# Altium schematic sheet unodongdiendienap.SchDoc
size A
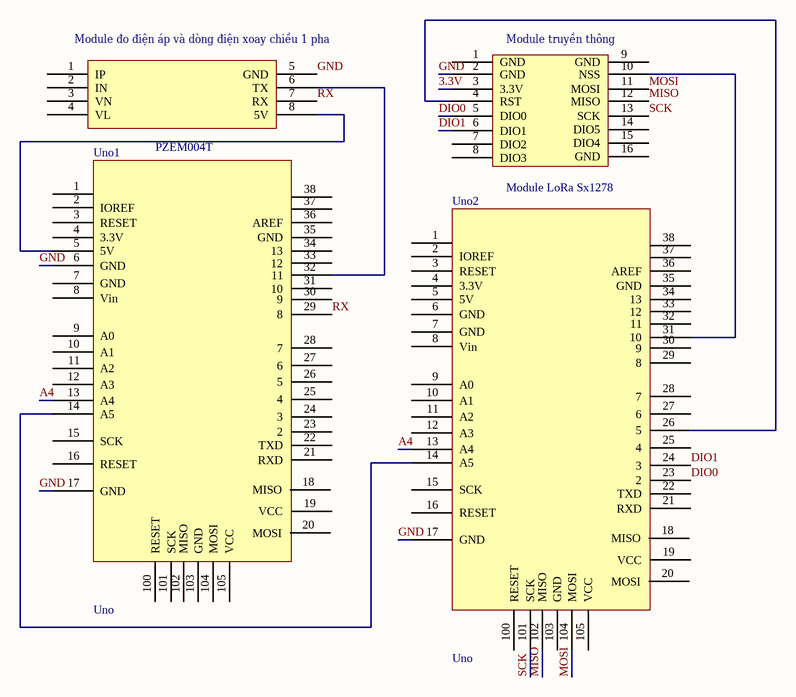
[diagram p0: unodongdiendienap.SchDoc]

## Parts
Module_truyền_thông  Module LoRa Sx1278  [PCBLoRa]
Module_đo_điện_áp_và_dòng_điện_xoay_chiều_1_pha  PZEM004T
Uno1  Uno  [PCBComponent_1]
Uno2  Uno  [PCBComponent_1]

## Nets
3.3V: Module_truyền_thông.3(3.3V)
A4: Uno1.13(A4) Uno2.13(A4)
DIO0: Module_truyền_thông.5(DIO0) Uno2.23(2)
DIO1: Module_truyền_thông.6(DIO1) Uno2.24(3)
GND: Module_truyền_thông.2(GND) Module_đo_điện_áp_và_dòng_điện_xoay_chiều_1_pha.5(GND) Uno1.6(GND) Uno1.17(GND) Uno2.17(GND)
MISO: Module_truyền_thông.12(MISO) Uno2.102(MISO)
MOSI: Module_truyền_thông.11(MOSI) Uno2.104(MOSI)
RX: Module_đo_điện_áp_và_dòng_điện_xoay_chiều_1_pha.7(RX) Uno1.29(8)
SCK: Module_truyền_thông.13(SCK) Uno2.101(SCK)
NetModule_truyền_thông_4: Module_truyền_thông.4(RST) Uno2.26(5)
NetModule_truyền_thông_10: Module_truyền_thông.10(NSS) Uno2.31(10)
NetModule_đo_điện_áp_và_dòng_điện_xoay_chiều_1_pha_6: Module_đo_điện_áp_và_dòng_điện_xoay_chiều_1_pha.6(TX) Uno1.32(11)
NetModule_đo_điện_áp_và_dòng_điện_xoay_chiều_1_pha_8: Module_đo_điện_áp_và_dòng_điện_xoay_chiều_1_pha.8(5V) Uno1.5(5V)
NetUno1_14: Uno1.14(A5) Uno2.14(A5)

Not connected (* = marked no-connect by the designer): Module_truyền_thông 1(GND) 7(DIO2) 8(DIO3) 9(GND) 14(DIO5) 15(DIO4) 16(GND); Module_đo_điện_áp_và_dòng_điện_xoay_chiều_1_pha 1(IP) 2(IN) 3(VN) 4(VL); Uno1 1 2(IOREF) 3(RESET) 4(3.3V) 7(GND) 8(Vin) 9(A0) 10(A1) 11(A2) 12(A3) 15(SCK) 16(RESET) 18(MISO) 19(VCC) 20(MOSI) 21(RXD) 22(TXD) 23(2) 24(3) 25(4) 26(5) 27(6) 28(7) 30(9) 31(10) 33(12) 34(13) 35(GND) 36(AREF) 37 38 100(RESET) 101(SCK) 102(MISO) 103(GND) 104(MOSI) 105(VCC); Uno2 1 2(IOREF) 3(RESET) 4(3.3V) 5(5V) 6(GND) 7(GND) 8(Vin) 9(A0) 10(A1) 11(A2) 12(A3) 15(SCK) 16(RESET) 18(MISO) 19(VCC) 20(MOSI) 21(RXD) 22(TXD) 25(4) 27(6) 28(7) 29(8) 30(9) 32(11) 33(12) 34(13) 35(GND) 36(AREF) 37 38 100(RESET) 103(GND) 105(VCC)

## Library data of the parts
Module_truyền_thông = Component_1